# Altium schematic sheet Colibri.SchDoc: Iris
size A3; Organization: Toradex AG; Address1: Altsagenstrasse 5; Address2: Horw; Address3: 6048; Address4: Switzerland; DocumentNumber: 4; Revision: V2.0; SheetNumber: 4; SheetTotal: 16
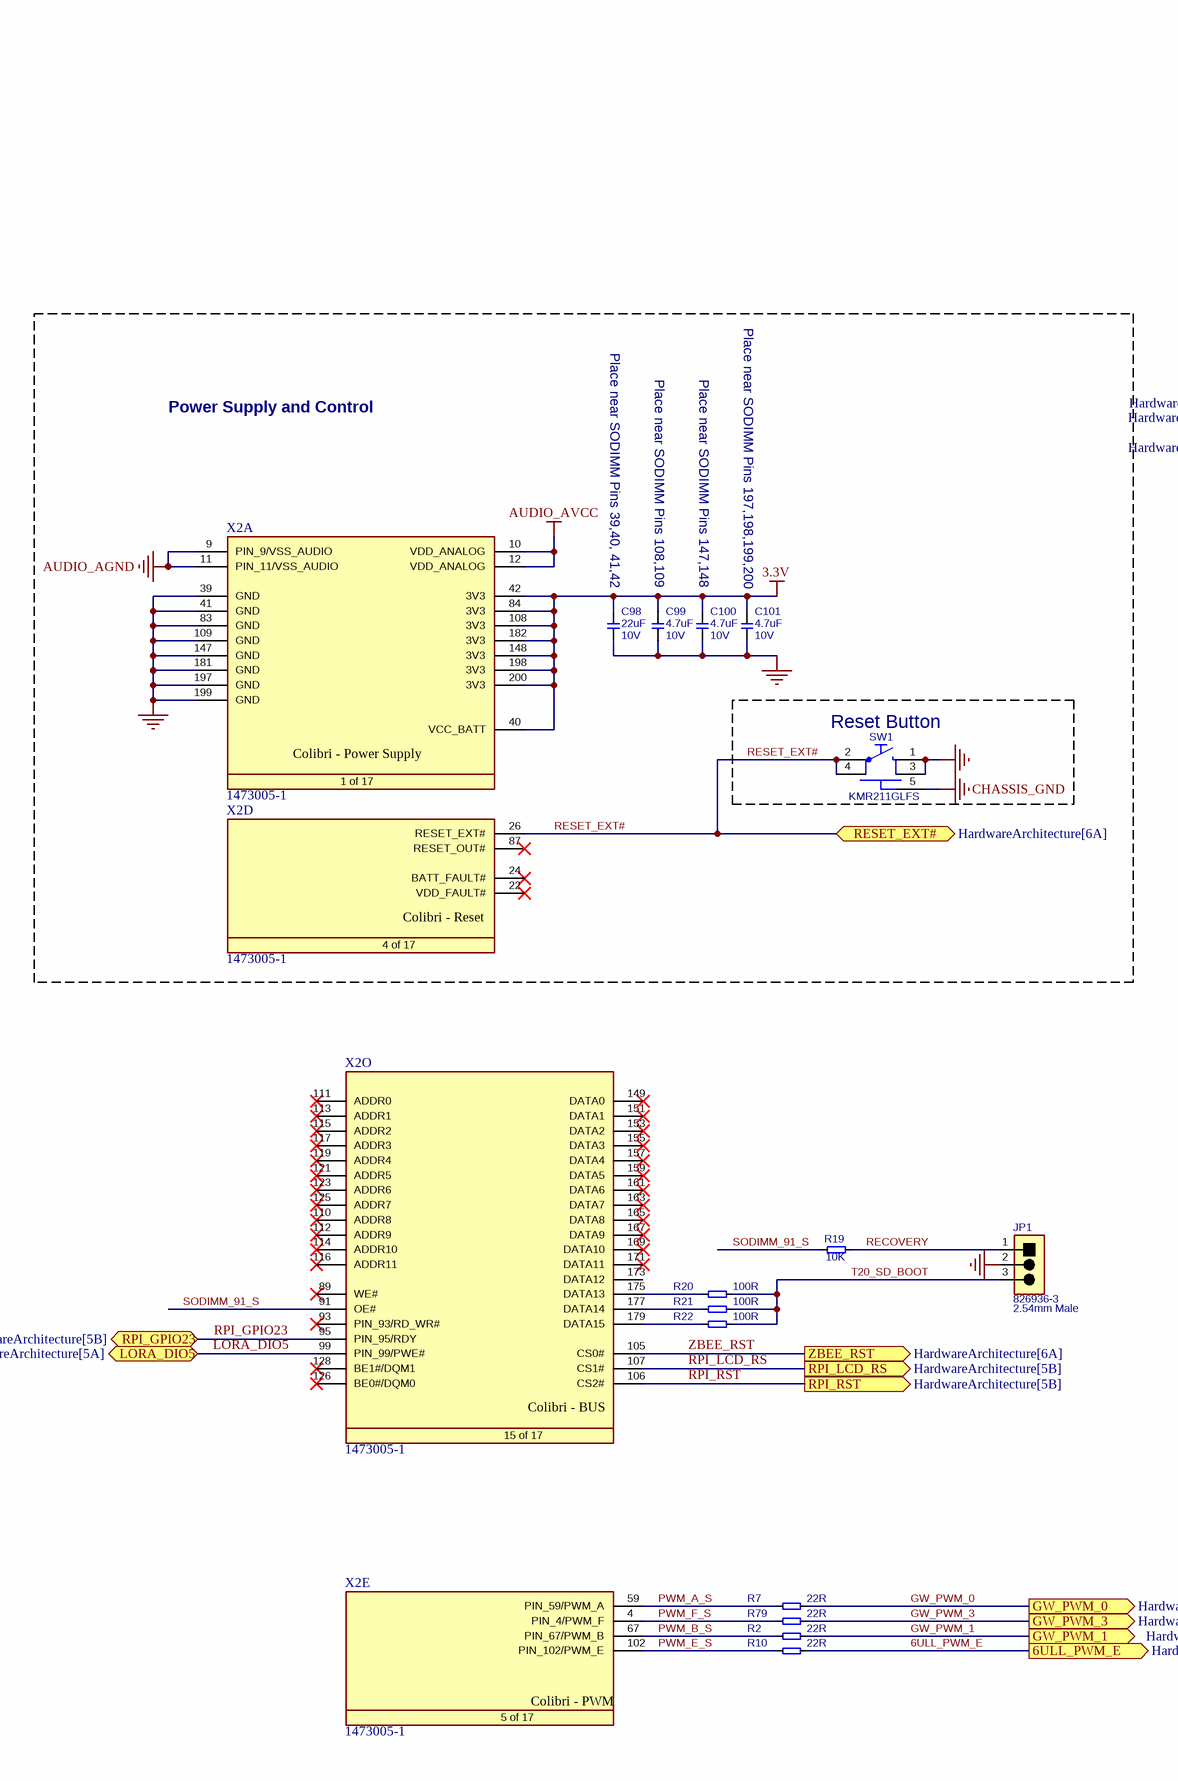
[diagram p0: Colibri.SchDoc, left]
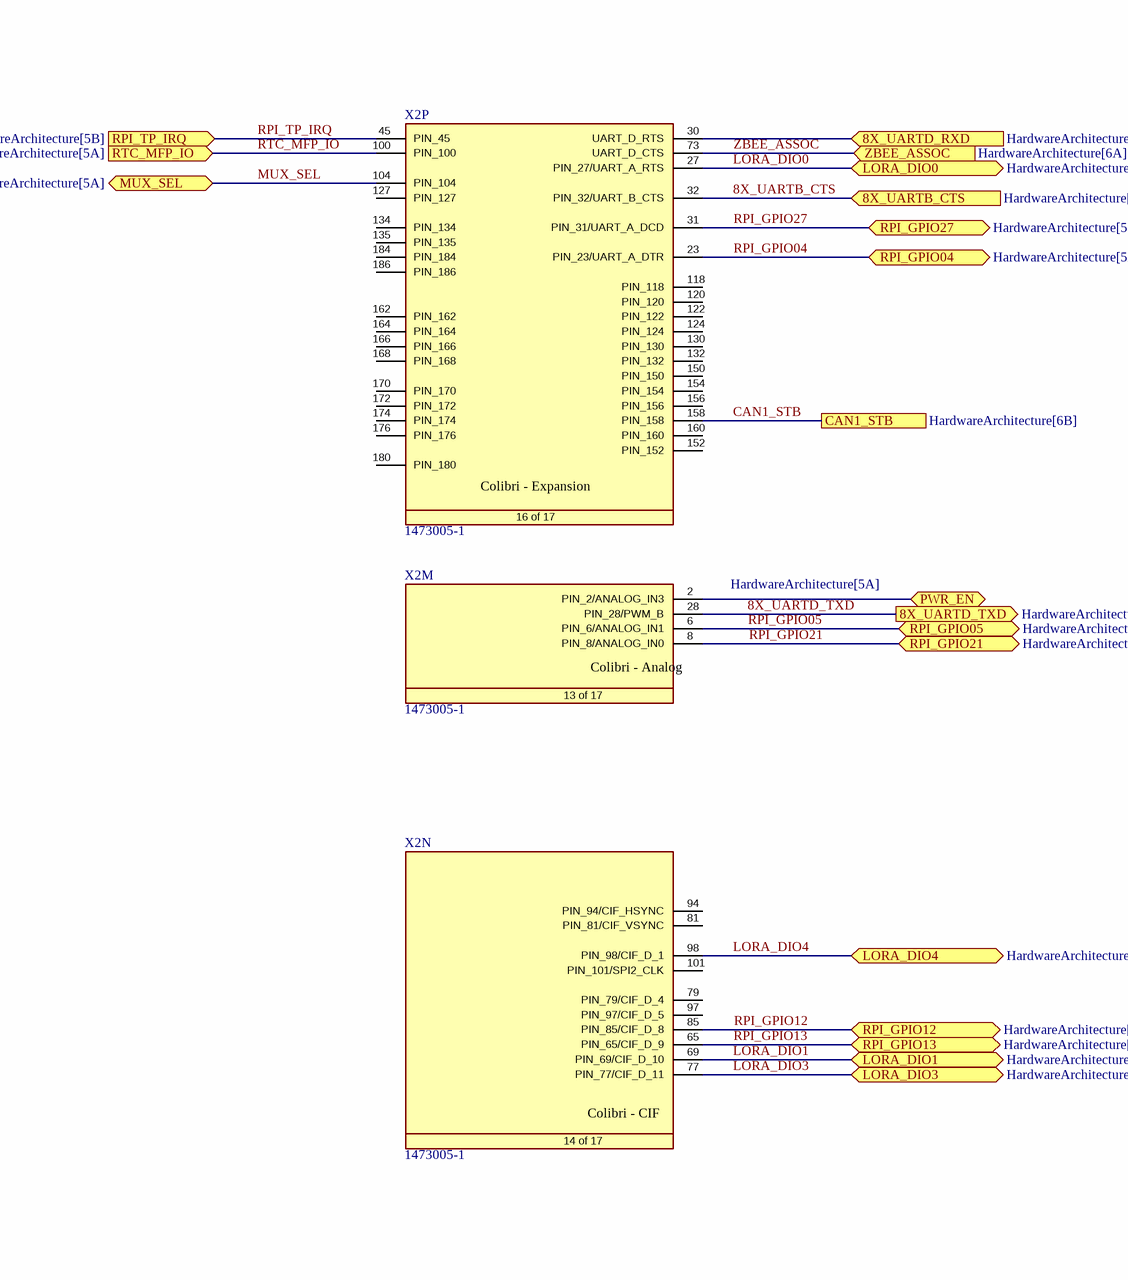
[diagram p1: Colibri.SchDoc, right]

## Parts
C98  Rating: 10V  [T_CAPC0805X125N]  (hidden comment: 22uF)
C99  Rating: 10V  [T_CAPC0603X33N]  (hidden comment: 4.7uF)
C100  Rating: 10V  [T_CAPC0603X33N]  (hidden comment: 4.7uF)
C101  Rating: 10V  [T_CAPC0603X33N]  (hidden comment: 4.7uF)
JP1  826936-3  [T_TYCO_826936-3]
R2  22R  [RESC1005X40N]
R7  22R  [RESC1005X40N]
R10  22R  [RESC1005X40N]
R19  10K  [RESC1005X40N]
R20  100R  [T_RESC0603X30N]
R21  100R  [T_RESC0603X30N]
R22  100R  [T_RESC0603X30N]
R79  22R  [RESC1005X40N]
SW1  KMR211GLFS  [T_CnK_KMR211GLFS]
X2  1473005-1  [T_Tyco_1473005-1]  (parts A,D,E,M,N,O,P of 17)

## Blocks framed on the sheet
Power Supply and Control: C98-C101 X2
Reset Button: SW1

## Ports
6ULL_PWM_E (out, see HardwareArchitecture[6B]), 8X_UARTB_CTS (in, see HardwareArchitecture[6B]), 8X_UARTD_RXD (in, see HardwareArchitecture[6B]), 8X_UARTD_TXD (out, see HardwareArchitecture[6B]), CAN1_STB (see HardwareArchitecture[6B]), GW_PWM_0 (out, see HardwareArchitecture[6A]), GW_PWM_1 (out, see HardwareArchitecture[6A]), GW_PWM_3 (out, see HardwareArchitecture[6A]), LORA_DIO0 (bidir, see HardwareArchitecture[5A]), LORA_DIO1 (bidir, see HardwareArchitecture[5A]), LORA_DIO3 (bidir, see HardwareArchitecture[5A]), LORA_DIO4 (bidir, see HardwareArchitecture[5A]), LORA_DIO5 (bidir, see HardwareArchitecture[5A]), MUX_SEL (bidir, see HardwareArchitecture[5A]), PWR_EN (bidir, see HardwareArchitecture[5A]), RESET_EXT# (bidir, see HardwareArchitecture[6A]), RPI_GPIO04 (bidir, see HardwareArchitecture[5A]), RPI_GPIO05 (bidir, see HardwareArchitecture[5A]), RPI_GPIO12 (bidir, see HardwareArchitecture[5A]), RPI_GPIO13 (bidir, see HardwareArchitecture[5A]), RPI_GPIO21 (bidir, see HardwareArchitecture[5B]), RPI_GPIO23 (bidir, see HardwareArchitecture[5B]), RPI_GPIO27 (bidir, see HardwareArchitecture[5B]), RPI_LCD_RS (out, see HardwareArchitecture[5B]), RPI_RST (out, see HardwareArchitecture[5B]), RPI_TP_IRQ (in, see HardwareArchitecture[5B]), RTC_MFP_IO (in, see HardwareArchitecture[5A]), ZBEE_ASSOC (in, see HardwareArchitecture[6A]), ZBEE_RST (out, see HardwareArchitecture[6A])

## Nets
3.3V: C98.2 C99.1 C100.1 C101.1 X2.40(VCC_BATT) X2.42(3V3) X2.84(3V3) X2.108(3V3) X2.148(3V3) X2.182(3V3) X2.198(3V3) X2.200(3V3)
AUDIO_AGND: X2.9(PIN_9/VSS_AUDIO) X2.11(PIN_11/VSS_AUDIO)
AUDIO_AVCC: X2.10(VDD_ANALOG) X2.12(VDD_ANALOG)
CHASSIS_GND: SW1.5
GND: C98.1 C99.2 C100.2 C101.2 JP1.2 SW1.1 SW1.3 X2.39(GND) X2.41(GND) X2.83(GND) X2.109(GND) X2.147(GND) X2.181(GND) X2.197(GND) X2.199(GND)
6ULL_PWM_E: R10.2 ; port 6ULL_PWM_E
8X_UARTB_CTS: X2.32(PIN_32/UART_B_CTS) ; port 8X_UARTB_CTS
8X_UARTD_RXD: X2.30(UART_D_RTS) ; port 8X_UARTD_RXD
8X_UARTD_TXD: X2.28(PIN_28/PWM_B) ; port 8X_UARTD_TXD
CAN1_STB: X2.158(PIN_158) ; port CAN1_STB
GW_PWM_0: R7.2 ; port GW_PWM_0
GW_PWM_1: R2.2 ; port GW_PWM_1
GW_PWM_3: R79.2 ; port GW_PWM_3
LORA_DIO0: X2.27(PIN_27/UART_A_RTS) ; port LORA_DIO0
LORA_DIO1: X2.69(PIN_69/CIF_D_10) ; port LORA_DIO1
LORA_DIO3: X2.77(PIN_77/CIF_D_11) ; port LORA_DIO3
LORA_DIO4: X2.98(PIN_98/CIF_D_1) ; port LORA_DIO4
LORA_DIO5: X2.99(PIN_99/PWE#) ; port LORA_DIO5
MUX_SEL: X2.104(PIN_104) ; port MUX_SEL
PWM_A_S: R7.1 X2.59(PIN_59/PWM_A)
PWM_B_S: R2.1 X2.67(PIN_67/PWM_B)
PWM_E_S: R10.1 X2.102(PIN_102/PWM_E)
PWM_F_S: R79.1 X2.4(PIN_4/PWM_F)
PWR_EN: X2.2(PIN_2/ANALOG_IN3) ; port PWR_EN
RECOVERY: JP1.1 R19.2
RESET_EXT#: SW1.2 SW1.4 X2.26(RESET_EXT#) ; port RESET_EXT#
RPI_GPIO04: X2.23(PIN_23/UART_A_DTR) ; port RPI_GPIO04
RPI_GPIO05: X2.6(PIN_6/ANALOG_IN1) ; port RPI_GPIO05
RPI_GPIO12: X2.85(PIN_85/CIF_D_8) ; port RPI_GPIO12
RPI_GPIO13: X2.65(PIN_65/CIF_D_9) ; port RPI_GPIO13
RPI_GPIO21: X2.8(PIN_8/ANALOG_IN0) ; port RPI_GPIO21
RPI_GPIO23: X2.95(PIN_95/RDY) ; port RPI_GPIO23
RPI_GPIO27: X2.31(PIN_31/UART_A_DCD) ; port RPI_GPIO27
RPI_LCD_RS: X2.107(CS1#) ; port RPI_LCD_RS
RPI_RST: X2.106(CS2#) ; port RPI_RST
RPI_TP_IRQ: X2.45(PIN_45) ; port RPI_TP_IRQ
RTC_MFP_IO: X2.100(PIN_100) ; port RTC_MFP_IO
SODIMM_91_S: R19.1 X2.91(OE#)
T20_SD_BOOT: JP1.3 R20.1 R21.1 R22.1
ZBEE_ASSOC: X2.73(UART_D_CTS) ; port ZBEE_ASSOC
ZBEE_RST: X2.105(CS0#) ; port ZBEE_RST
NetR20_2: R20.2 X2.175(DATA13)
NetR21_2: R21.2 X2.177(DATA14)
NetR22_2: R22.2 X2.179(DATA15)

Not connected (* = marked no-connect by the designer): X2 22(VDD_FAULT#)* 24(BATT_FAULT#)* 79(PIN_79/CIF_D_4) 81(PIN_81/CIF_VSYNC) 87(RESET_OUT#)* 89(WE#)* 93(PIN_93/RD_WR#)* 94(PIN_94/CIF_HSYNC) 97(PIN_97/CIF_D_5) 101(PIN_101/SPI2_CLK) 110(ADDR8)* 111(ADDR0)* 112(ADDR9)* 113(ADDR1)* 114(ADDR10)* 115(ADDR2)* 116(ADDR11)* 117(ADDR3)* 118(PIN_118) 119(ADDR4)* 120(PIN_120) 121(ADDR5)* 122(PIN_122) 123(ADDR6)* 124(PIN_124) 125(ADDR7)* 126(BE0#/DQM0)* 127(PIN_127) 128(BE1#/DQM1)* 130(PIN_130) 132(PIN_132) 134(PIN_134) 135(PIN_135) 149(DATA0)* 150(PIN_150) 151(DATA1)* 152(PIN_152) 153(DATA2)* 154(PIN_154) 155(DATA3)* 156(PIN_156) 157(DATA4)* 159(DATA5)* 160(PIN_160) 161(DATA6)* 162(PIN_162) 163(DATA7)* 164(PIN_164) 165(DATA8)* 166(PIN_166) 167(DATA9)* 168(PIN_168) 169(DATA10)* 170(PIN_170) 171(DATA11)* 172(PIN_172) 173(DATA12) 174(PIN_174) 176(PIN_176) 180(PIN_180) 184(PIN_184) 186(PIN_186)

## Notes on the sheet
- Place near SODIMM Pins 39,40, 41,42
- Place near SODIMM Pins 197,198,199,200
- Place near SODIMM Pins 108,109
- Place near SODIMM Pins 147,148
- (near JP1) 2.54mm Male
- Title
- Size:
- Date:
- A3
- Number:
- Time:
- Revision:
- Sheet
- of
- File:
- (in symbol CON-Tyco-1473005-1-200-0.6mm, part A) Colibri - Power Supply; 1 of 17
- (in symbol CON-Tyco-1473005-1-200-0.6mm, part D) Colibri - Reset; 4 of 17
- (in symbol CON-Tyco-1473005-1-200-0.6mm, part E) Colibri - PWM; 5 of 17
- (in symbol CON-Tyco-1473005-1-200-0.6mm, part M) Colibri - Analog; 13 of 17
- (in symbol CON-Tyco-1473005-1-200-0.6mm, part N) Colibri - CIF; 14 of 17
- (in symbol CON-Tyco-1473005-1-200-0.6mm, part O) Colibri - BUS; 15 of 17
- (in symbol CON-Tyco-1473005-1-200-0.6mm, part P) Colibri - Expansion; 16 of 17

## Library data of the parts
C98 = C-X5R-22uF-10V-20%-0805: Capacitor Ceramic X5R 22uF 10V 20% 0805; Tolerance: 20%; Type: X5R; Value: 22uF
C99-C101 = C-X5R-4.7uF-10V-10%-0603: Capacitor Ceramic X5R 4.7uF 10V 10% 0603; Manufacturer Name: Generic; Tolerance: 10%; Type: X5R; Value: 4.7uF; Manufacturer Part No.: *
JP1 = CON-Tyco-826936-3-1X3-2.54mm-JP: Jumper, 3-Pin; Manufacturer Name: Tyco; No. of ways: 1X3; Pitch: 2.54mm; Manufacturer Part No.: 826936-3
R2 R7 R10 R79 = R-22R-63mW-5%-0402: Resistor 22 ohm 63mW 5% 0402; Rating: 63mW; Tolerance: 5%; Value: 22R
R19 = R-10KR-63mW-1%-0402: Resistor 10 Kohm 63mW 1% 0402; Value: 10KR; Rating: 63mW; Tolerance: 1%
R20-R22 = R-100R-63mW-5%-0603: Resistor 100 ohm 63mW 5% 0603; Rating: 63mW; Tolerance: 5%; Value: 100R
SW1 = SW_CnK-KMR211GLFS-1VA: Power ON Switch; Manufacturer Name: C&N; Rating: 1VA; Manufacturer Part No.: KMR211GLFS
X2 = CON-Tyco-1473005-1-200-0.6mm: SODIMM Connector; Manufacturer Name: Tyco; No. of ways: 200; Manufacturer Part No.: 1473005-1